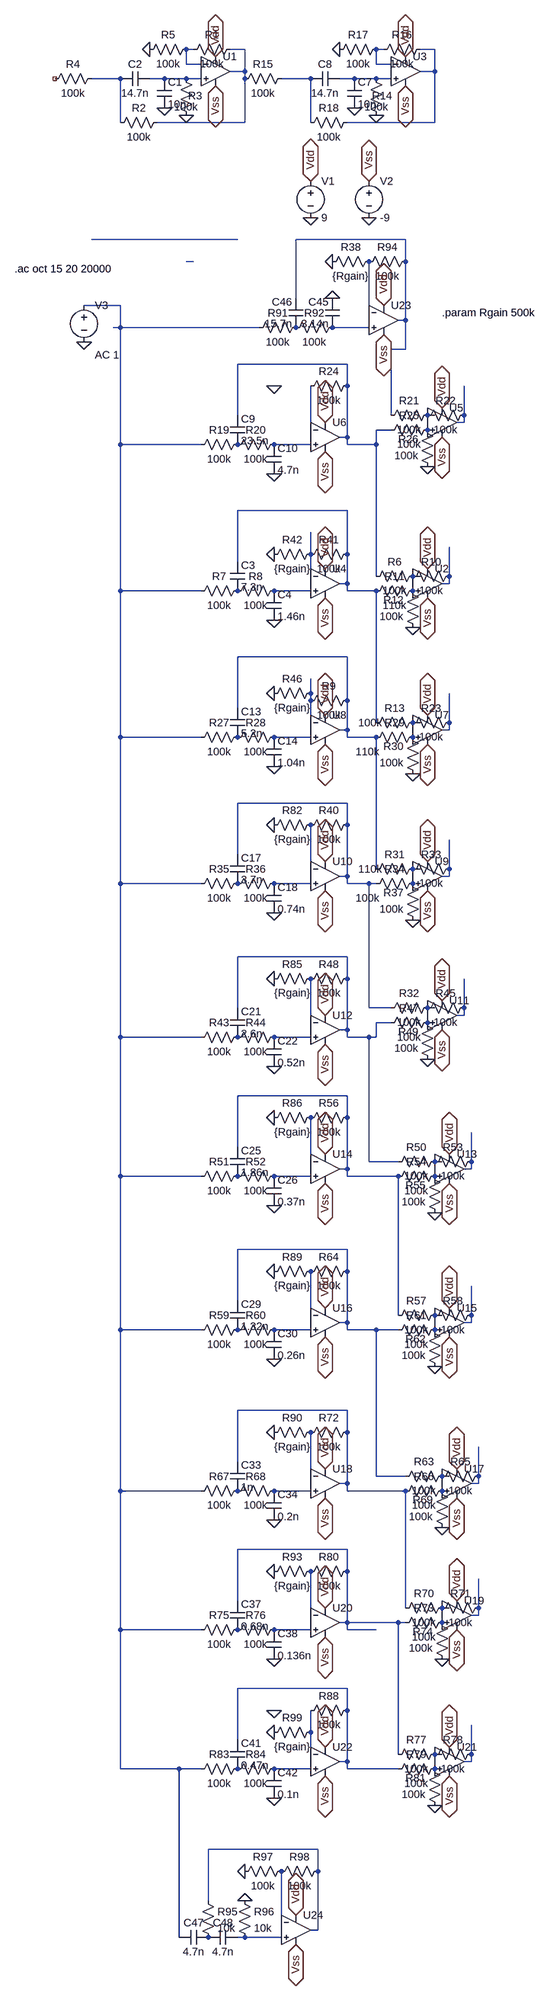
[diagram p0: schematic VocoderFilterV2.asc]
VocoderFilterV2.asc, the LTspice schematic file:
Version 4
SHEET 1 1016 3860
WIRE 48 -384 32 -384
WIRE 160 -384 128 -384
WIRE 464 -384 448 -384
WIRE 576 -384 544 -384
WIRE 32 -352 32 -384
WIRE 64 -352 32 -352
WIRE 448 -352 448 -384
WIRE 480 -352 448 -352
WIRE 160 -336 160 -384
WIRE 160 -336 128 -336
WIRE 576 -336 576 -384
WIRE 576 -336 544 -336
WIRE -112 -320 -176 -320
WIRE -16 -320 -48 -320
WIRE 32 -320 -16 -320
WIRE 64 -320 32 -320
WIRE 160 -320 160 -336
WIRE 304 -320 240 -320
WIRE 400 -320 368 -320
WIRE 448 -320 400 -320
WIRE 480 -320 448 -320
WIRE -112 -224 -112 -320
WIRE 160 -224 160 -320
WIRE 160 -224 -32 -224
WIRE 304 -224 304 -320
WIRE 576 -224 576 -336
WIRE 576 -224 384 -224
WIRE 144 32 -176 32
WIRE 512 32 272 32
WIRE 48 80 32 80
WIRE 512 80 512 32
WIRE 272 160 272 32
WIRE -112 176 -192 176
WIRE 432 192 432 80
WIRE 512 208 512 80
WIRE 512 208 496 208
WIRE -112 224 -112 176
WIRE -112 224 -128 224
WIRE 192 224 -112 224
WIRE 432 224 352 224
WIRE 512 272 512 208
WIRE 512 272 480 272
WIRE 384 304 144 304
WIRE 384 352 384 304
WIRE 144 416 144 304
WIRE 480 416 480 272
WIRE 640 416 640 352
WIRE 640 432 640 416
WIRE 640 432 624 432
WIRE 304 448 304 352
WIRE 480 448 448 448
WIRE 384 464 384 352
WIRE 384 464 368 464
WIRE -112 480 -112 224
WIRE 64 480 -112 480
WIRE 304 480 224 480
WIRE 384 480 384 464
WIRE 448 480 448 448
WIRE 448 480 384 480
WIRE 384 624 144 624
WIRE 304 720 304 672
WIRE 384 720 384 624
WIRE 144 736 144 624
WIRE 304 768 304 720
WIRE 448 768 448 480
WIRE 608 768 608 704
WIRE 384 784 384 720
WIRE 384 784 368 784
WIRE 608 784 608 768
WIRE 608 784 592 784
WIRE -112 800 -112 480
WIRE 64 800 -112 800
WIRE 304 800 224 800
WIRE 384 800 384 784
WIRE 448 800 384 800
WIRE 384 944 144 944
WIRE 304 1024 304 992
WIRE 304 1040 304 1024
WIRE 384 1040 384 944
WIRE 144 1056 144 944
WIRE 304 1088 304 1040
WIRE 448 1088 448 800
WIRE 608 1088 608 1024
WIRE 384 1104 384 1040
WIRE 384 1104 368 1104
WIRE 608 1104 608 1088
WIRE 608 1104 592 1104
WIRE -112 1120 -112 800
WIRE 64 1120 -112 1120
WIRE 304 1120 224 1120
WIRE 384 1120 384 1104
WIRE 448 1120 384 1120
WIRE 384 1264 144 1264
WIRE 384 1312 384 1264
WIRE 144 1376 144 1264
WIRE 304 1408 304 1312
WIRE 448 1408 448 1120
WIRE 608 1408 608 1344
WIRE 384 1424 384 1312
WIRE 384 1424 368 1424
WIRE 608 1424 608 1408
WIRE 608 1424 592 1424
WIRE -112 1440 -112 1120
WIRE 64 1440 -112 1440
WIRE 304 1440 224 1440
WIRE 384 1440 384 1424
WIRE 432 1440 384 1440
WIRE 448 1440 432 1440
WIRE 384 1600 144 1600
WIRE 384 1648 384 1600
WIRE 144 1712 144 1600
WIRE 432 1712 432 1440
WIRE 480 1712 432 1712
WIRE 640 1712 640 1648
WIRE 640 1728 640 1712
WIRE 640 1728 624 1728
WIRE 304 1744 304 1648
WIRE 480 1744 448 1744
WIRE 384 1760 384 1648
WIRE 384 1760 368 1760
WIRE -112 1776 -112 1440
WIRE 64 1776 -112 1776
WIRE 304 1776 224 1776
WIRE 384 1776 384 1760
WIRE 432 1776 384 1776
WIRE 448 1776 448 1744
WIRE 448 1776 432 1776
WIRE 384 1904 144 1904
WIRE 384 1952 384 1904
WIRE 144 2016 144 1904
WIRE 304 2048 304 1952
WIRE 432 2048 432 1776
WIRE 496 2048 432 2048
WIRE 656 2048 656 1984
WIRE 384 2064 384 1952
WIRE 384 2064 368 2064
WIRE 656 2064 656 2048
WIRE 656 2064 640 2064
WIRE -112 2080 -112 1776
WIRE 64 2080 -112 2080
WIRE 304 2080 224 2080
WIRE 384 2080 384 2064
WIRE 496 2080 384 2080
WIRE 384 2240 144 2240
WIRE 384 2288 384 2240
WIRE 144 2352 144 2240
WIRE 304 2384 304 2288
WIRE 496 2384 496 2080
WIRE 656 2384 656 2320
WIRE 384 2400 384 2288
WIRE 384 2400 368 2400
WIRE 656 2400 656 2384
WIRE 656 2400 640 2400
WIRE -112 2416 -112 2080
WIRE 64 2416 -112 2416
WIRE 304 2416 224 2416
WIRE 384 2416 384 2400
WIRE 448 2416 384 2416
WIRE 496 2416 448 2416
WIRE 384 2592 144 2592
WIRE 384 2640 384 2592
WIRE 144 2704 144 2592
WIRE 304 2736 304 2640
WIRE 448 2736 448 2416
WIRE 512 2736 448 2736
WIRE 672 2736 672 2672
WIRE 384 2752 384 2640
WIRE 384 2752 368 2752
WIRE 672 2752 672 2736
WIRE 672 2752 656 2752
WIRE -112 2768 -112 2416
WIRE 64 2768 -112 2768
WIRE 304 2768 224 2768
WIRE 384 2768 384 2752
WIRE 512 2768 384 2768
WIRE 384 2896 144 2896
WIRE 384 2944 384 2896
WIRE 144 3008 144 2896
WIRE 512 3024 512 2768
WIRE 672 3024 672 2960
WIRE 304 3040 304 2944
WIRE 672 3040 672 3024
WIRE 672 3040 656 3040
WIRE 384 3056 384 2944
WIRE 384 3056 368 3056
WIRE 496 3056 384 3056
WIRE 512 3056 496 3056
WIRE -112 3072 -112 2768
WIRE 64 3072 -112 3072
WIRE 304 3072 224 3072
WIRE 384 3072 384 3056
WIRE 448 3072 384 3072
WIRE 384 3200 144 3200
WIRE 384 3248 384 3200
WIRE 304 3296 304 3248
WIRE 144 3312 144 3200
WIRE 304 3344 304 3296
WIRE 496 3344 496 3056
WIRE 656 3344 656 3280
WIRE 384 3360 384 3248
WIRE 384 3360 368 3360
WIRE 656 3360 656 3344
WIRE 656 3360 640 3360
WIRE -112 3376 -112 3072
WIRE 16 3376 -112 3376
WIRE 64 3376 16 3376
WIRE 304 3376 224 3376
WIRE 384 3376 384 3360
WIRE 496 3376 384 3376
WIRE 320 3552 80 3552
WIRE 320 3600 320 3552
WIRE 80 3664 80 3552
WIRE 240 3712 240 3600
WIRE 320 3728 320 3600
WIRE 320 3728 304 3728
WIRE 16 3744 16 3376
WIRE 160 3744 144 3744
WIRE 240 3744 160 3744
FLAG 32 -240 0
FLAG -16 -256 0
FLAG 432 -16 0
FLAG 304 -16 0
FLAG -192 256 0
FLAG -48 -384 0
FLAG 304 -96 Vdd
IOPIN 304 -96 BiDir
FLAG 96 -304 Vss
IOPIN 96 -304 BiDir
FLAG 224 864 0
FLAG 432 -96 Vss
IOPIN 432 -96 BiDir
FLAG 96 -368 Vdd
IOPIN 96 -368 BiDir
FLAG 448 -240 0
FLAG 400 -256 0
FLAG 368 -384 0
FLAG 512 -304 Vss
IOPIN 512 -304 BiDir
FLAG 512 -368 Vdd
IOPIN 512 -368 BiDir
FLAG 336 816 Vss
IOPIN 336 816 BiDir
FLAG 336 752 Vdd
IOPIN 336 752 BiDir
FLAG 224 544 0
FLAG 336 496 Vss
IOPIN 336 496 BiDir
FLAG 336 432 Vdd
IOPIN 336 432 BiDir
FLAG 224 1184 0
FLAG 336 1136 Vss
IOPIN 336 1136 BiDir
FLAG 336 1072 Vdd
IOPIN 336 1072 BiDir
FLAG 224 1504 0
FLAG 336 1456 Vss
IOPIN 336 1456 BiDir
FLAG 336 1392 Vdd
IOPIN 336 1392 BiDir
FLAG 224 1840 0
FLAG 336 1792 Vss
IOPIN 336 1792 BiDir
FLAG 336 1728 Vdd
IOPIN 336 1728 BiDir
FLAG 224 2144 0
FLAG 336 2096 Vss
IOPIN 336 2096 BiDir
FLAG 336 2032 Vdd
IOPIN 336 2032 BiDir
FLAG 224 1952 0
FLAG 224 2480 0
FLAG 336 2432 Vss
IOPIN 336 2432 BiDir
FLAG 336 2368 Vdd
IOPIN 336 2368 BiDir
FLAG 224 2288 0
FLAG 224 2832 0
FLAG 336 2784 Vss
IOPIN 336 2784 BiDir
FLAG 336 2720 Vdd
IOPIN 336 2720 BiDir
FLAG 224 2640 0
FLAG 224 3136 0
FLAG 336 3088 Vss
IOPIN 336 3088 BiDir
FLAG 336 3024 Vdd
IOPIN 336 3024 BiDir
FLAG 224 2944 0
FLAG 224 3440 0
FLAG 336 3392 Vss
IOPIN 336 3392 BiDir
FLAG 336 3328 Vdd
IOPIN 336 3328 BiDir
FLAG 224 3248 0
FLAG 352 160 0
FLAG 464 240 Vss
IOPIN 464 240 BiDir
FLAG 464 176 Vdd
IOPIN 464 176 BiDir
FLAG 160 3664 0
FLAG 272 3760 Vss
IOPIN 272 3760 BiDir
FLAG 272 3696 Vdd
IOPIN 272 3696 BiDir
FLAG 160 3600 0
FLAG 592 464 Vss
IOPIN 592 464 BiDir
FLAG 592 400 Vdd
IOPIN 592 400 BiDir
FLAG 560 528 0
FLAG 560 816 Vss
IOPIN 560 816 BiDir
FLAG 560 752 Vdd
IOPIN 560 752 BiDir
FLAG 528 880 0
FLAG 560 1136 Vss
IOPIN 560 1136 BiDir
FLAG 560 1072 Vdd
IOPIN 560 1072 BiDir
FLAG 528 1200 0
FLAG 560 1456 Vss
IOPIN 560 1456 BiDir
FLAG 560 1392 Vdd
IOPIN 560 1392 BiDir
FLAG 528 1520 0
FLAG 224 352 0
FLAG 352 80 0
FLAG 224 720 0
FLAG 224 1024 0
FLAG 592 1760 Vss
IOPIN 592 1760 BiDir
FLAG 592 1696 Vdd
IOPIN 592 1696 BiDir
FLAG 560 1824 0
FLAG 608 2096 Vss
IOPIN 608 2096 BiDir
FLAG 608 2032 Vdd
IOPIN 608 2032 BiDir
FLAG 576 2160 0
FLAG 608 2432 Vss
IOPIN 608 2432 BiDir
FLAG 608 2368 Vdd
IOPIN 608 2368 BiDir
FLAG 576 2496 0
FLAG 624 2784 Vss
IOPIN 624 2784 BiDir
FLAG 624 2720 Vdd
IOPIN 624 2720 BiDir
FLAG 592 2848 0
FLAG 624 3072 Vss
IOPIN 624 3072 BiDir
FLAG 624 3008 Vdd
IOPIN 624 3008 BiDir
FLAG 592 3136 0
FLAG 608 3392 Vss
IOPIN 608 3392 BiDir
FLAG 608 3328 Vdd
IOPIN 608 3328 BiDir
FLAG 576 3456 0
FLAG 224 1312 0
FLAG 224 1648 0
FLAG 224 3296 0
SYMBOL res 48 -224 R180
WINDOW 0 -19 58 Left 2
WINDOW 3 -10 34 Left 2
SYMATTR InstName R3
SYMATTR Value 100k
SYMBOL cap -32 -320 R0
SYMATTR InstName C1
SYMATTR Value 10n
SYMBOL cap -48 -336 R90
WINDOW 0 0 32 VBottom 2
WINDOW 3 32 32 VTop 2
SYMATTR InstName C2
SYMATTR Value 14.7n
SYMBOL res -160 -336 R90
WINDOW 0 0 56 VBottom 2
WINDOW 3 32 56 VTop 2
SYMATTR InstName R4
SYMATTR Value 100k
SYMBOL voltage 304 -112 R0
WINDOW 123 0 0 Left 0
WINDOW 39 0 0 Left 0
SYMATTR InstName V1
SYMATTR Value 9
SYMBOL voltage 432 -112 R0
WINDOW 123 0 0 Left 0
WINDOW 39 0 0 Left 0
SYMATTR InstName V2
SYMATTR Value -9
SYMBOL voltage -192 160 R0
WINDOW 123 24 124 Left 2
WINDOW 39 0 0 Left 0
SYMATTR Value2 AC 1
SYMATTR InstName V3
SYMATTR Value ""
SYMBOL Opamps\\UniversalOpamp2 96 -336 R0
SYMATTR InstName U1
SYMBOL res 144 -400 R90
WINDOW 0 0 56 VBottom 2
WINDOW 3 32 56 VTop 2
SYMATTR InstName R1
SYMATTR Value 100k
SYMBOL res 48 -400 R90
WINDOW 0 0 56 VBottom 2
WINDOW 3 32 56 VTop 2
SYMATTR InstName R5
SYMATTR Value 100k
SYMBOL res -16 -240 R90
WINDOW 0 0 56 VBottom 2
WINDOW 3 32 56 VTop 2
SYMATTR InstName R2
SYMATTR Value 100k
SYMBOL cap 128 736 R0
SYMATTR InstName C3
SYMATTR Value 7.3n
SYMBOL res 160 784 R90
WINDOW 0 0 56 VBottom 2
WINDOW 3 32 56 VTop 2
SYMATTR InstName R7
SYMATTR Value 100k
SYMBOL cap 208 800 R0
SYMATTR InstName C4
SYMATTR Value 1.46n
SYMBOL res 240 784 R90
WINDOW 0 0 56 VBottom 2
WINDOW 3 32 56 VTop 2
SYMATTR InstName R8
SYMATTR Value 100k
SYMBOL res 464 -224 R180
WINDOW 0 -19 58 Left 2
WINDOW 3 -10 34 Left 2
SYMATTR InstName R14
SYMATTR Value 100k
SYMBOL cap 384 -320 R0
SYMATTR InstName C7
SYMATTR Value 10n
SYMBOL cap 368 -336 R90
WINDOW 0 0 32 VBottom 2
WINDOW 3 32 32 VTop 2
SYMATTR InstName C8
SYMATTR Value 14.7n
SYMBOL res 256 -336 R90
WINDOW 0 0 56 VBottom 2
WINDOW 3 32 56 VTop 2
SYMATTR InstName R15
SYMATTR Value 100k
SYMBOL Opamps\\UniversalOpamp2 512 -336 R0
SYMATTR InstName U3
SYMBOL res 560 -400 R90
WINDOW 0 0 56 VBottom 2
WINDOW 3 32 56 VTop 2
SYMATTR InstName R16
SYMATTR Value 100k
SYMBOL res 464 -400 R90
WINDOW 0 0 56 VBottom 2
WINDOW 3 32 56 VTop 2
SYMATTR InstName R17
SYMATTR Value 100k
SYMBOL res 400 -240 R90
WINDOW 0 0 56 VBottom 2
WINDOW 3 32 56 VTop 2
SYMATTR InstName R18
SYMATTR Value 100k
SYMBOL Opamps\\UniversalOpamp2 336 784 R0
SYMATTR InstName U4
SYMBOL cap 128 416 R0
SYMATTR InstName C9
SYMATTR Value 23.5n
SYMBOL res 160 464 R90
WINDOW 0 0 56 VBottom 2
WINDOW 3 32 56 VTop 2
SYMATTR InstName R19
SYMATTR Value 100k
SYMBOL cap 208 480 R0
SYMATTR InstName C10
SYMATTR Value 4.7n
SYMBOL res 240 464 R90
WINDOW 0 0 56 VBottom 2
WINDOW 3 32 56 VTop 2
SYMATTR InstName R20
SYMATTR Value 100k
SYMBOL Opamps\\UniversalOpamp2 336 464 R0
SYMATTR InstName U6
SYMBOL res 400 336 R90
WINDOW 0 0 56 VBottom 2
WINDOW 3 32 56 VTop 2
SYMATTR InstName R24
SYMATTR Value 100k
SYMBOL cap 128 1056 R0
SYMATTR InstName C13
SYMATTR Value 5.2n
SYMBOL res 160 1104 R90
WINDOW 0 0 56 VBottom 2
WINDOW 3 32 56 VTop 2
SYMATTR InstName R27
SYMATTR Value 100k
SYMBOL cap 208 1120 R0
SYMATTR InstName C14
SYMATTR Value 1.04n
SYMBOL res 240 1104 R90
WINDOW 0 0 56 VBottom 2
WINDOW 3 32 56 VTop 2
SYMATTR InstName R28
SYMATTR Value 100k
SYMBOL Opamps\\UniversalOpamp2 336 1104 R0
SYMATTR InstName U8
SYMBOL cap 128 1376 R0
SYMATTR InstName C17
SYMATTR Value 3.7n
SYMBOL res 160 1424 R90
WINDOW 0 0 56 VBottom 2
WINDOW 3 32 56 VTop 2
SYMATTR InstName R35
SYMATTR Value 100k
SYMBOL cap 208 1440 R0
SYMATTR InstName C18
SYMATTR Value 0.74n
SYMBOL res 240 1424 R90
WINDOW 0 0 56 VBottom 2
WINDOW 3 32 56 VTop 2
SYMATTR InstName R36
SYMATTR Value 100k
SYMBOL Opamps\\UniversalOpamp2 336 1424 R0
SYMATTR InstName U10
SYMBOL res 400 1296 R90
WINDOW 0 0 56 VBottom 2
WINDOW 3 32 56 VTop 2
SYMATTR InstName R40
SYMATTR Value 100k
SYMBOL cap 128 1712 R0
SYMATTR InstName C21
SYMATTR Value 2.6n
SYMBOL res 160 1760 R90
WINDOW 0 0 56 VBottom 2
WINDOW 3 32 56 VTop 2
SYMATTR InstName R43
SYMATTR Value 100k
SYMBOL cap 208 1776 R0
SYMATTR InstName C22
SYMATTR Value 0.52n
SYMBOL res 240 1760 R90
WINDOW 0 0 56 VBottom 2
WINDOW 3 32 56 VTop 2
SYMATTR InstName R44
SYMATTR Value 100k
SYMBOL Opamps\\UniversalOpamp2 336 1760 R0
SYMATTR InstName U12
SYMBOL res 400 1632 R90
WINDOW 0 0 56 VBottom 2
WINDOW 3 32 56 VTop 2
SYMATTR InstName R48
SYMATTR Value 100k
SYMBOL cap 128 2016 R0
SYMATTR InstName C25
SYMATTR Value 1.86n
SYMBOL res 160 2064 R90
WINDOW 0 0 56 VBottom 2
WINDOW 3 32 56 VTop 2
SYMATTR InstName R51
SYMATTR Value 100k
SYMBOL cap 208 2080 R0
SYMATTR InstName C26
SYMATTR Value 0.37n
SYMBOL res 240 2064 R90
WINDOW 0 0 56 VBottom 2
WINDOW 3 32 56 VTop 2
SYMATTR InstName R52
SYMATTR Value 100k
SYMBOL Opamps\\UniversalOpamp2 336 2064 R0
SYMATTR InstName U14
SYMBOL res 400 1936 R90
WINDOW 0 0 56 VBottom 2
WINDOW 3 32 56 VTop 2
SYMATTR InstName R56
SYMATTR Value 100k
SYMBOL cap 128 2352 R0
SYMATTR InstName C29
SYMATTR Value 1.32n
SYMBOL res 160 2400 R90
WINDOW 0 0 56 VBottom 2
WINDOW 3 32 56 VTop 2
SYMATTR InstName R59
SYMATTR Value 100k
SYMBOL cap 208 2416 R0
SYMATTR InstName C30
SYMATTR Value 0.26n
SYMBOL res 240 2400 R90
WINDOW 0 0 56 VBottom 2
WINDOW 3 32 56 VTop 2
SYMATTR InstName R60
SYMATTR Value 100k
SYMBOL Opamps\\UniversalOpamp2 336 2400 R0
SYMATTR InstName U16
SYMBOL res 400 2272 R90
WINDOW 0 0 56 VBottom 2
WINDOW 3 32 56 VTop 2
SYMATTR InstName R64
SYMATTR Value 100k
SYMBOL cap 128 2704 R0
SYMATTR InstName C33
SYMATTR Value 1n
SYMBOL res 160 2752 R90
WINDOW 0 0 56 VBottom 2
WINDOW 3 32 56 VTop 2
SYMATTR InstName R67
SYMATTR Value 100k
SYMBOL cap 208 2768 R0
SYMATTR InstName C34
SYMATTR Value 0.2n
SYMBOL res 240 2752 R90
WINDOW 0 0 56 VBottom 2
WINDOW 3 32 56 VTop 2
SYMATTR InstName R68
SYMATTR Value 100k
SYMBOL Opamps\\UniversalOpamp2 336 2752 R0
SYMATTR InstName U18
SYMBOL res 400 2624 R90
WINDOW 0 0 56 VBottom 2
WINDOW 3 32 56 VTop 2
SYMATTR InstName R72
SYMATTR Value 100k
SYMBOL cap 128 3008 R0
SYMATTR InstName C37
SYMATTR Value 0.68n
SYMBOL res 160 3056 R90
WINDOW 0 0 56 VBottom 2
WINDOW 3 32 56 VTop 2
SYMATTR InstName R75
SYMATTR Value 100k
SYMBOL cap 208 3072 R0
SYMATTR InstName C38
SYMATTR Value 0.136n
SYMBOL res 240 3056 R90
WINDOW 0 0 56 VBottom 2
WINDOW 3 32 56 VTop 2
SYMATTR InstName R76
SYMATTR Value 100k
SYMBOL Opamps\\UniversalOpamp2 336 3056 R0
SYMATTR InstName U20
SYMBOL res 400 2928 R90
WINDOW 0 0 56 VBottom 2
WINDOW 3 32 56 VTop 2
SYMATTR InstName R80
SYMATTR Value 100k
SYMBOL cap 128 3312 R0
SYMATTR InstName C41
SYMATTR Value 0.47n
SYMBOL res 160 3360 R90
WINDOW 0 0 56 VBottom 2
WINDOW 3 32 56 VTop 2
SYMATTR InstName R83
SYMATTR Value 100k
SYMBOL cap 208 3376 R0
SYMATTR InstName C42
SYMATTR Value 0.1n
SYMBOL res 240 3360 R90
WINDOW 0 0 56 VBottom 2
WINDOW 3 32 56 VTop 2
SYMATTR InstName R84
SYMATTR Value 100k
SYMBOL Opamps\\UniversalOpamp2 336 3360 R0
SYMATTR InstName U22
SYMBOL res 400 3232 R90
WINDOW 0 0 56 VBottom 2
WINDOW 3 32 56 VTop 2
SYMATTR InstName R88
SYMATTR Value 100k
SYMBOL res 288 208 R90
WINDOW 0 0 56 VBottom 2
WINDOW 3 32 56 VTop 2
SYMATTR InstName R91
SYMATTR Value 100k
SYMBOL cap 368 224 R180
WINDOW 0 24 56 Left 2
WINDOW 3 24 8 Left 2
SYMATTR InstName C45
SYMATTR Value 3.14n
SYMBOL cap 288 224 R180
WINDOW 0 24 56 Left 2
WINDOW 3 24 8 Left 2
SYMATTR InstName C46
SYMATTR Value 15.7n
SYMBOL res 368 208 R90
WINDOW 0 0 56 VBottom 2
WINDOW 3 32 56 VTop 2
SYMATTR InstName R92
SYMATTR Value 100k
SYMBOL Opamps\\UniversalOpamp2 464 208 R0
SYMATTR InstName U23
SYMBOL res 528 64 R90
WINDOW 0 0 56 VBottom 2
WINDOW 3 32 56 VTop 2
SYMATTR InstName R94
SYMATTR Value 100k
SYMBOL res 64 3648 R0
SYMATTR InstName R95
SYMATTR Value 10k
SYMBOL cap 80 3728 R90
WINDOW 0 0 32 VBottom 2
WINDOW 3 32 32 VTop 2
SYMATTR InstName C47
SYMATTR Value 4.7n
SYMBOL cap 144 3728 R90
WINDOW 0 0 32 VBottom 2
WINDOW 3 32 32 VTop 2
SYMATTR InstName C48
SYMATTR Value 4.7n
SYMBOL res 144 3648 R0
SYMATTR InstName R96
SYMATTR Value 10k
SYMBOL Opamps\\UniversalOpamp2 272 3728 R0
SYMATTR InstName U24
SYMBOL res 256 3584 R90
WINDOW 0 0 56 VBottom 2
WINDOW 3 32 56 VTop 2
SYMATTR InstName R97
SYMATTR Value 100k
SYMBOL res 336 3584 R90
WINDOW 0 0 56 VBottom 2
WINDOW 3 32 56 VTop 2
SYMATTR InstName R98
SYMATTR Value 100k
SYMBOL Opamps\\UniversalOpamp2 592 432 R0
SYMATTR InstName U5
SYMBOL res 576 400 R90
WINDOW 0 0 56 VBottom 2
WINDOW 3 32 56 VTop 2
SYMATTR InstName R21
SYMATTR Value 100k
SYMBOL res 656 400 R90
WINDOW 0 0 56 VBottom 2
WINDOW 3 32 56 VTop 2
SYMATTR InstName R22
SYMATTR Value 100k
SYMBOL res 576 432 R90
WINDOW 0 0 56 VBottom 2
WINDOW 3 32 56 VTop 2
SYMATTR InstName R25
SYMATTR Value 100k
SYMBOL res 576 544 R180
WINDOW 0 36 76 Left 2
WINDOW 3 36 40 Left 2
SYMATTR InstName R26
SYMATTR Value 100k
SYMBOL Opamps\\UniversalOpamp2 560 784 R0
SYMATTR InstName U2
SYMBOL res 544 752 R90
WINDOW 0 0 56 VBottom 2
WINDOW 3 32 56 VTop 2
SYMATTR InstName R6
SYMATTR Value 100k
SYMBOL res 624 752 R90
WINDOW 0 0 56 VBottom 2
WINDOW 3 32 56 VTop 2
SYMATTR InstName R10
SYMATTR Value 100k
SYMBOL res 544 784 R90
WINDOW 0 0 56 VBottom 2
WINDOW 3 32 56 VTop 2
SYMATTR InstName R11
SYMATTR Value 110k
SYMBOL res 544 896 R180
WINDOW 0 36 76 Left 2
WINDOW 3 36 40 Left 2
SYMATTR InstName R12
SYMATTR Value 100k
SYMBOL Opamps\\UniversalOpamp2 560 1104 R0
SYMATTR InstName U7
SYMBOL res 544 1072 R90
WINDOW 0 0 56 VBottom 2
WINDOW 3 1 109 VTop 2
SYMATTR InstName R13
SYMATTR Value 100k
SYMBOL res 624 1072 R90
WINDOW 0 0 56 VBottom 2
WINDOW 3 32 56 VTop 2
SYMATTR InstName R23
SYMATTR Value 100k
SYMBOL res 544 1104 R90
WINDOW 0 0 56 VBottom 2
WINDOW 3 32 115 VTop 2
SYMATTR InstName R29
SYMATTR Value 110k
SYMBOL res 544 1216 R180
WINDOW 0 36 76 Left 2
WINDOW 3 36 40 Left 2
SYMATTR InstName R30
SYMATTR Value 100k
SYMBOL Opamps\\UniversalOpamp2 560 1424 R0
SYMATTR InstName U9
SYMBOL res 544 1392 R90
WINDOW 0 0 56 VBottom 2
WINDOW 3 1 109 VTop 2
SYMATTR InstName R31
SYMATTR Value 110k
SYMBOL res 624 1392 R90
WINDOW 0 0 56 VBottom 2
WINDOW 3 32 56 VTop 2
SYMATTR InstName R33
SYMATTR Value 100k
SYMBOL res 544 1424 R90
WINDOW 0 0 56 VBottom 2
WINDOW 3 32 115 VTop 2
SYMATTR InstName R34
SYMATTR Value 100k
SYMBOL res 544 1536 R180
WINDOW 0 36 76 Left 2
WINDOW 3 36 40 Left 2
SYMATTR InstName R37
SYMATTR Value 100k
SYMBOL res 448 64 R90
WINDOW 0 0 56 VBottom 2
WINDOW 3 32 56 VTop 2
SYMATTR InstName R38
SYMATTR Value {Rgain}
SYMBOL res 400 704 R90
WINDOW 0 0 56 VBottom 2
WINDOW 3 32 56 VTop 2
SYMATTR InstName R41
SYMATTR Value 100k
SYMBOL res 320 704 R90
WINDOW 0 0 56 VBottom 2
WINDOW 3 32 56 VTop 2
SYMATTR InstName R42
SYMATTR Value {Rgain}
SYMBOL res 320 1008 R90
WINDOW 0 0 56 VBottom 2
WINDOW 3 32 56 VTop 2
SYMATTR InstName R46
SYMATTR Value {Rgain}
SYMBOL res 400 1024 R90
WINDOW 0 0 56 VBottom 2
WINDOW 3 32 56 VTop 2
SYMATTR InstName R9
SYMATTR Value 100k
SYMBOL Opamps\\UniversalOpamp2 592 1728 R0
SYMATTR InstName U11
SYMBOL res 576 1696 R90
WINDOW 0 0 56 VBottom 2
WINDOW 3 32 56 VTop 2
SYMATTR InstName R32
SYMATTR Value 100k
SYMBOL res 656 1696 R90
WINDOW 0 0 56 VBottom 2
WINDOW 3 32 56 VTop 2
SYMATTR InstName R45
SYMATTR Value 100k
SYMBOL res 576 1728 R90
WINDOW 0 0 56 VBottom 2
WINDOW 3 32 56 VTop 2
SYMATTR InstName R47
SYMATTR Value 100k
SYMBOL res 576 1840 R180
WINDOW 0 36 76 Left 2
WINDOW 3 36 40 Left 2
SYMATTR InstName R49
SYMATTR Value 100k
SYMBOL Opamps\\UniversalOpamp2 608 2064 R0
SYMATTR InstName U13
SYMBOL res 592 2032 R90
WINDOW 0 0 56 VBottom 2
WINDOW 3 32 56 VTop 2
SYMATTR InstName R50
SYMATTR Value 100k
SYMBOL res 672 2032 R90
WINDOW 0 0 56 VBottom 2
WINDOW 3 32 56 VTop 2
SYMATTR InstName R53
SYMATTR Value 100k
SYMBOL res 592 2064 R90
WINDOW 0 0 56 VBottom 2
WINDOW 3 32 56 VTop 2
SYMATTR InstName R54
SYMATTR Value 100k
SYMBOL res 592 2176 R180
WINDOW 0 36 76 Left 2
WINDOW 3 36 40 Left 2
SYMATTR InstName R55
SYMATTR Value 100k
SYMBOL Opamps\\UniversalOpamp2 608 2400 R0
SYMATTR InstName U15
SYMBOL res 592 2368 R90
WINDOW 0 0 56 VBottom 2
WINDOW 3 32 56 VTop 2
SYMATTR InstName R57
SYMATTR Value 100k
SYMBOL res 672 2368 R90
WINDOW 0 0 56 VBottom 2
WINDOW 3 32 56 VTop 2
SYMATTR InstName R58
SYMATTR Value 100k
SYMBOL res 592 2400 R90
WINDOW 0 0 56 VBottom 2
WINDOW 3 32 56 VTop 2
SYMATTR InstName R61
SYMATTR Value 100k
SYMBOL res 592 2512 R180
WINDOW 0 36 76 Left 2
WINDOW 3 36 40 Left 2
SYMATTR InstName R62
SYMATTR Value 100k
SYMBOL Opamps\\UniversalOpamp2 624 2752 R0
SYMATTR InstName U17
SYMBOL res 608 2720 R90
WINDOW 0 0 56 VBottom 2
WINDOW 3 32 56 VTop 2
SYMATTR InstName R63
SYMATTR Value 100k
SYMBOL res 688 2720 R90
WINDOW 0 0 56 VBottom 2
WINDOW 3 32 56 VTop 2
SYMATTR InstName R65
SYMATTR Value 100k
SYMBOL res 608 2752 R90
WINDOW 0 0 56 VBottom 2
WINDOW 3 32 56 VTop 2
SYMATTR InstName R66
SYMATTR Value 100k
SYMBOL res 608 2864 R180
WINDOW 0 36 76 Left 2
WINDOW 3 36 40 Left 2
SYMATTR InstName R69
SYMATTR Value 100k
SYMBOL Opamps\\UniversalOpamp2 624 3040 R0
SYMATTR InstName U19
SYMBOL res 608 3008 R90
WINDOW 0 0 56 VBottom 2
WINDOW 3 32 56 VTop 2
SYMATTR InstName R70
SYMATTR Value 100k
SYMBOL res 688 3008 R90
WINDOW 0 0 56 VBottom 2
WINDOW 3 32 56 VTop 2
SYMATTR InstName R71
SYMATTR Value 100k
SYMBOL res 608 3040 R90
WINDOW 0 0 56 VBottom 2
WINDOW 3 32 56 VTop 2
SYMATTR InstName R73
SYMATTR Value 100k
SYMBOL res 608 3152 R180
WINDOW 0 36 76 Left 2
WINDOW 3 36 40 Left 2
SYMATTR InstName R74
SYMATTR Value 100k
SYMBOL Opamps\\UniversalOpamp2 608 3360 R0
SYMATTR InstName U21
SYMBOL res 592 3328 R90
WINDOW 0 0 56 VBottom 2
WINDOW 3 32 56 VTop 2
SYMATTR InstName R77
SYMATTR Value 100k
SYMBOL res 672 3328 R90
WINDOW 0 0 56 VBottom 2
WINDOW 3 32 56 VTop 2
SYMATTR InstName R78
SYMATTR Value 100k
SYMBOL res 592 3360 R90
WINDOW 0 0 56 VBottom 2
WINDOW 3 32 56 VTop 2
SYMATTR InstName R79
SYMATTR Value 100k
SYMBOL res 592 3472 R180
WINDOW 0 36 76 Left 2
WINDOW 3 36 40 Left 2
SYMATTR InstName R81
SYMATTR Value 100k
SYMBOL res 320 1296 R90
WINDOW 0 0 56 VBottom 2
WINDOW 3 32 56 VTop 2
SYMATTR InstName R82
SYMATTR Value {Rgain}
SYMBOL res 320 1632 R90
WINDOW 0 0 56 VBottom 2
WINDOW 3 32 56 VTop 2
SYMATTR InstName R85
SYMATTR Value {Rgain}
SYMBOL res 320 1936 R90
WINDOW 0 0 56 VBottom 2
WINDOW 3 32 56 VTop 2
SYMATTR InstName R86
SYMATTR Value {Rgain}
SYMBOL res 320 2272 R90
WINDOW 0 0 56 VBottom 2
WINDOW 3 32 56 VTop 2
SYMATTR InstName R89
SYMATTR Value {Rgain}
SYMBOL res 320 2624 R90
WINDOW 0 0 56 VBottom 2
WINDOW 3 32 56 VTop 2
SYMATTR InstName R90
SYMATTR Value {Rgain}
SYMBOL res 320 2928 R90
WINDOW 0 0 56 VBottom 2
WINDOW 3 32 56 VTop 2
SYMATTR InstName R93
SYMATTR Value {Rgain}
SYMBOL res 320 3280 R90
WINDOW 0 0 56 VBottom 2
WINDOW 3 32 56 VTop 2
SYMATTR InstName R99
SYMATTR Value {Rgain}
TEXT -344 96 Left 2 !.ac oct 15 20 20000
TEXT 592 192 Left 2 !.param Rgain 500k

The netlist it stands for:
* VocoderFilterV2.asc
R3 0 N006 100k
C1 N006 0 10n
C2 N006 N005 14.7n
R4 N005 NC_01 100k
V1 Vdd 0 9
V2 Vss 0 -9
V3 N012 0 AC 1
XU1 N006 N001 Vdd Vss N002 level.2 Avol=1Meg GBW=10Meg Slew=10Meg ilimit=25m rail=0 Vos=0 phimargin=45 en=0 enk=0 in=0 ink=0 Rin=500Meg  ; pins IN+ IN- V+ V- OUT
R1 N002 N001 100k
R5 N001 0 100k
R2 N002 N005 100k
C3 N019 P001 7.3n
R7 P001 N012 100k
C4 N022 0 1.46n
R8 N022 P001 100k
R14 0 N008 100k
C7 N008 0 10n
C8 N008 N007 14.7n
R15 N007 N002 100k
XU3 N008 N003 Vdd Vss N004 level.2 Avol=1Meg GBW=10Meg Slew=10Meg ilimit=25m rail=0 Vos=0 phimargin=45 en=0 enk=0 in=0 ink=0 Rin=500Meg  ; pins IN+ IN- V+ V- OUT
R16 N004 N003 100k
R17 N003 0 100k
R18 N004 N007 100k
XU4 N022 N020 Vdd Vss N019 level.2 Avol=1Meg GBW=10Meg Slew=10Meg ilimit=25m rail=0 Vos=0 phimargin=45 en=0 enk=0 in=0 ink=0 Rin=500Meg  ; pins IN+ IN- V+ V- OUT
C9 N015 P002 23.5n
R19 P002 N012 100k
C10 N018 0 4.7n
R20 N018 P002 100k
XU6 N018 N017 Vdd Vss N015 level.2 Avol=1Meg GBW=10Meg Slew=10Meg ilimit=25m rail=0 Vos=0 phimargin=45 en=0 enk=0 in=0 ink=0 Rin=500Meg  ; pins IN+ IN- V+ V- OUT
R24 N015 N017 100k
C13 N023 P003 5.2n
R27 P003 N012 100k
C14 N026 0 1.04n
R28 N026 P003 100k
XU8 N026 N024 Vdd Vss N023 level.2 Avol=1Meg GBW=10Meg Slew=10Meg ilimit=25m rail=0 Vos=0 phimargin=45 en=0 enk=0 in=0 ink=0 Rin=500Meg  ; pins IN+ IN- V+ V- OUT
C17 N027 P004 3.7n
R35 P004 N012 100k
C18 N030 0 0.74n
R36 N030 P004 100k
XU10 N030 N028 Vdd Vss N027 level.2 Avol=1Meg GBW=10Meg Slew=10Meg ilimit=25m rail=0 Vos=0 phimargin=45 en=0 enk=0 in=0 ink=0 Rin=500Meg  ; pins IN+ IN- V+ V- OUT
R40 N027 N028 100k
C21 N031 P005 2.6n
R43 P005 N012 100k
C22 N034 0 0.52n
R44 N034 P005 100k
XU12 N034 N033 Vdd Vss N031 level.2 Avol=1Meg GBW=10Meg Slew=10Meg ilimit=25m rail=0 Vos=0 phimargin=45 en=0 enk=0 in=0 ink=0 Rin=500Meg  ; pins IN+ IN- V+ V- OUT
R48 N031 N033 100k
C25 N035 P006 1.86n
R51 P006 N012 100k
C26 N038 0 0.37n
R52 N038 P006 100k
XU14 N038 N036 Vdd Vss N035 level.2 Avol=1Meg GBW=10Meg Slew=10Meg ilimit=25m rail=0 Vos=0 phimargin=45 en=0 enk=0 in=0 ink=0 Rin=500Meg  ; pins IN+ IN- V+ V- OUT
R56 N035 N036 100k
C29 N039 P007 1.32n
R59 P007 N012 100k
C30 N042 0 0.26n
R60 N042 P007 100k
XU16 N042 N040 Vdd Vss N039 level.2 Avol=1Meg GBW=10Meg Slew=10Meg ilimit=25m rail=0 Vos=0 phimargin=45 en=0 enk=0 in=0 ink=0 Rin=500Meg  ; pins IN+ IN- V+ V- OUT
R64 N039 N040 100k
C33 N043 P008 1n
R67 P008 N012 100k
C34 N046 0 0.2n
R68 N046 P008 100k
XU18 N046 N044 Vdd Vss N043 level.2 Avol=1Meg GBW=10Meg Slew=10Meg ilimit=25m rail=0 Vos=0 phimargin=45 en=0 enk=0 in=0 ink=0 Rin=500Meg  ; pins IN+ IN- V+ V- OUT
R72 N043 N044 100k
C37 N047 P009 0.68n
R75 P009 N012 100k
C38 N050 0 0.136n
R76 N050 P009 100k
XU20 N050 N049 Vdd Vss N047 level.2 Avol=1Meg GBW=10Meg Slew=10Meg ilimit=25m rail=0 Vos=0 phimargin=45 en=0 enk=0 in=0 ink=0 Rin=500Meg  ; pins IN+ IN- V+ V- OUT
R80 N047 N049 100k
C41 N051 P010 0.47n
R83 P010 N012 100k
C42 N054 0 0.1n
R84 N054 P010 100k
XU22 N054 N052 Vdd Vss N051 level.2 Avol=1Meg GBW=10Meg Slew=10Meg ilimit=25m rail=0 Vos=0 phimargin=45 en=0 enk=0 in=0 ink=0 Rin=500Meg  ; pins IN+ IN- V+ V- OUT
R88 N051 N052 100k
R91 P011 N012 100k
C45 N014 0 3.14n
C46 P011 N010 15.7n
R92 N014 P011 100k
XU23 N014 N013 Vdd Vss N010 level.2 Avol=1Meg GBW=10Meg Slew=10Meg ilimit=25m rail=0 Vos=0 phimargin=45 en=0 enk=0 in=0 ink=0 Rin=500Meg  ; pins IN+ IN- V+ V- OUT
R94 N010 N013 100k
R95 N055 P012 10k
C47 P012 N012 4.7n
C48 N057 P012 4.7n
R96 0 N057 10k
XU24 N057 N056 Vdd Vss N055 level.2 Avol=1Meg GBW=10Meg Slew=10Meg ilimit=25m rail=0 Vos=0 phimargin=45 en=0 enk=0 in=0 ink=0 Rin=500Meg  ; pins IN+ IN- V+ V- OUT
R97 N056 0 100k
R98 N055 N056 100k
XU5 P013 P014 Vdd Vss N016 level.2 Avol=1Meg GBW=10Meg Slew=10Meg ilimit=25m rail=0 Vos=0 phimargin=45 en=0 enk=0 in=0 ink=0 Rin=500Meg  ; pins IN+ IN- V+ V- OUT
R21 P014 N010 100k
R22 N016 P014 100k
R25 P013 N015 100k
R26 0 P013 100k
XU2 P015 P016 Vdd Vss N021 level.2 Avol=1Meg GBW=10Meg Slew=10Meg ilimit=25m rail=0 Vos=0 phimargin=45 en=0 enk=0 in=0 ink=0 Rin=500Meg  ; pins IN+ IN- V+ V- OUT
R6 P016 N015 100k
R10 N021 P016 100k
R11 P015 N019 110k
R12 0 P015 100k
XU7 P017 P018 Vdd Vss N025 level.2 Avol=1Meg GBW=10Meg Slew=10Meg ilimit=25m rail=0 Vos=0 phimargin=45 en=0 enk=0 in=0 ink=0 Rin=500Meg  ; pins IN+ IN- V+ V- OUT
R13 P018 N019 100k
R23 N025 P018 100k
R29 P017 N023 110k
R30 0 P017 100k
XU9 P019 P020 Vdd Vss N029 level.2 Avol=1Meg GBW=10Meg Slew=10Meg ilimit=25m rail=0 Vos=0 phimargin=45 en=0 enk=0 in=0 ink=0 Rin=500Meg  ; pins IN+ IN- V+ V- OUT
R31 P020 N023 110k
R33 N029 P020 100k
R34 P019 N027 100k
R37 0 P019 100k
R38 N013 0 {Rgain}
R41 N019 N020 100k
R42 N020 0 {Rgain}
R46 N024 0 {Rgain}
R9 N023 N024 100k
XU11 P021 P022 Vdd Vss N032 level.2 Avol=1Meg GBW=10Meg Slew=10Meg ilimit=25m rail=0 Vos=0 phimargin=45 en=0 enk=0 in=0 ink=0 Rin=500Meg  ; pins IN+ IN- V+ V- OUT
R32 P022 N027 100k
R45 N032 P022 100k
R47 P021 N031 100k
R49 0 P021 100k
XU13 P023 P024 Vdd Vss N037 level.2 Avol=1Meg GBW=10Meg Slew=10Meg ilimit=25m rail=0 Vos=0 phimargin=45 en=0 enk=0 in=0 ink=0 Rin=500Meg  ; pins IN+ IN- V+ V- OUT
R50 P024 N031 100k
R53 N037 P024 100k
R54 P023 N035 100k
R55 0 P023 100k
XU15 P025 P026 Vdd Vss N041 level.2 Avol=1Meg GBW=10Meg Slew=10Meg ilimit=25m rail=0 Vos=0 phimargin=45 en=0 enk=0 in=0 ink=0 Rin=500Meg  ; pins IN+ IN- V+ V- OUT
R57 P026 N035 100k
R58 N041 P026 100k
R61 P025 N039 100k
R62 0 P025 100k
XU17 P027 P028 Vdd Vss N045 level.2 Avol=1Meg GBW=10Meg Slew=10Meg ilimit=25m rail=0 Vos=0 phimargin=45 en=0 enk=0 in=0 ink=0 Rin=500Meg  ; pins IN+ IN- V+ V- OUT
R63 P028 N039 100k
R65 N045 P028 100k
R66 P027 N043 100k
R69 0 P027 100k
XU19 P029 P030 Vdd Vss N048 level.2 Avol=1Meg GBW=10Meg Slew=10Meg ilimit=25m rail=0 Vos=0 phimargin=45 en=0 enk=0 in=0 ink=0 Rin=500Meg  ; pins IN+ IN- V+ V- OUT
R70 P030 N043 100k
R71 N048 P030 100k
R73 P029 N047 100k
R74 0 P029 100k
XU21 P031 P032 Vdd Vss N053 level.2 Avol=1Meg GBW=10Meg Slew=10Meg ilimit=25m rail=0 Vos=0 phimargin=45 en=0 enk=0 in=0 ink=0 Rin=500Meg  ; pins IN+ IN- V+ V- OUT
R77 P032 N047 100k
R78 N053 P032 100k
R79 P031 N051 100k
R81 0 P031 100k
R82 N028 0 {Rgain}
R85 N033 0 {Rgain}
R86 N036 0 {Rgain}
R89 N040 0 {Rgain}
R90 N044 0 {Rgain}
R93 N049 0 {Rgain}
R99 N052 0 {Rgain}
.ac oct 15 20 20000
.param Rgain 500k
.lib UniversalOpamps2.sub
.backanno
.end